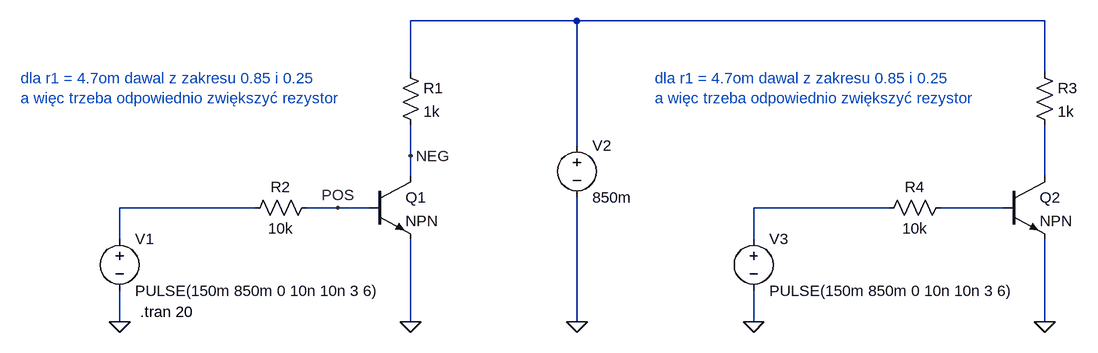
[diagram p0: schematic diff_output_trans.asc]
diff_output_trans.asc, the LTspice schematic file:
Version 4.1
SHEET 1 1320 680
WIRE 544 -112 288 -112
WIRE 1264 -112 544 -112
WIRE 288 -32 288 -112
WIRE 1264 -32 1264 -112
WIRE 544 80 544 -112
WIRE 288 96 288 48
WIRE 288 128 288 96
WIRE 1264 128 1264 48
WIRE 48 176 -160 176
WIRE 176 176 128 176
WIRE 224 176 176 176
WIRE 1024 176 816 176
WIRE 1200 176 1104 176
WIRE -160 224 -160 176
WIRE 816 224 816 176
WIRE -160 352 -160 304
WIRE 288 352 288 224
WIRE 544 352 544 160
WIRE 816 352 816 304
WIRE 1264 352 1264 224
FLAG 288 352 0
FLAG -160 352 0
FLAG 544 352 0
FLAG 1264 352 0
FLAG 816 352 0
FLAG 176 176 POS
FLAG 288 96 NEG
SYMBOL npn 224 128 R0
SYMATTR InstName Q1
SYMBOL res 272 -48 R0
SYMATTR InstName R1
SYMATTR Value 1k
SYMBOL res 144 160 R90
WINDOW 0 0 56 VBottom 2
WINDOW 3 32 56 VTop 2
SYMATTR InstName R2
SYMATTR Value 10k
SYMBOL voltage -160 208 R0
WINDOW 123 0 0 Left 0
WINDOW 39 0 0 Left 0
SYMATTR InstName V1
SYMATTR Value PULSE(150m 850m 0 10n 10n 3 6)
SYMBOL voltage 544 64 R0
WINDOW 123 0 0 Left 0
WINDOW 39 0 0 Left 0
SYMATTR InstName V2
SYMATTR Value 850m
SYMBOL npn 1200 128 R0
SYMATTR InstName Q2
SYMBOL res 1248 -48 R0
SYMATTR InstName R3
SYMATTR Value 1k
SYMBOL res 1120 160 R90
WINDOW 0 0 56 VBottom 2
WINDOW 3 32 56 VTop 2
SYMATTR InstName R4
SYMATTR Value 10k
SYMBOL voltage 816 208 R0
WINDOW 123 0 0 Left 0
WINDOW 39 0 0 Left 0
SYMATTR InstName V3
SYMATTR Value PULSE(150m 850m 0 10n 10n 3 6)
TEXT -128 336 Left 2 !.tran 20
TEXT -312 -24 Left 2 ;dla r1 = 4.7om dawal z zakresu 0.85 i 0.25 \na więc trzeba odpowiednio zwiększyć rezystor
TEXT 664 -24 Left 2 ;dla r1 = 4.7om dawal z zakresu 0.85 i 0.25 \na więc trzeba odpowiednio zwiększyć rezystor

The netlist it stands for:
* diff_output_trans.asc
Q1 NEG POS 0 0 NPN
R1 N001 NEG 1k
R2 POS N003 10k
V1 N003 0 PULSE(150m 850m 0 10n 10n 3 6)
V2 N001 0 850m
Q2 N002 N005 0 0 NPN
R3 N001 N002 1k
R4 N005 N004 10k
V3 N004 0 PULSE(150m 850m 0 10n 10n 3 6)
.model NPN NPN
.model PNP PNP
.lib standard.bjt
.tran 20
* dla r1 = 4.7om dawal z zakresu 0.85 i 0.25
* a więc trzeba odpowiednio zwiększyć rezystor
* dla r1 = 4.7om dawal z zakresu 0.85 i 0.25
* a więc trzeba odpowiednio zwiększyć rezystor
.backanno
.end

* Results of the author's LTspice run, read from the files saved beside the schematic
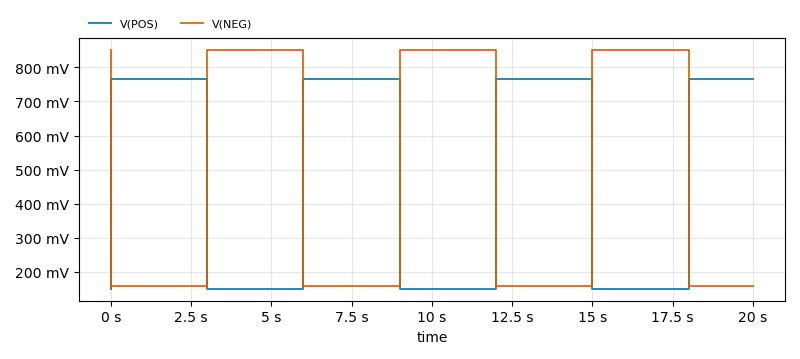
[diagram p1: Transient Analysis of diff_output_trans.asc, plotted from the saved traces]
* Transient Analysis, 1 run:
*   V(POS): min 150 mV, max 764.8 mV, average 488.2 mV, rms 576.1 mV, last 764.8 mV
*   V(NEG): min 157.7 mV, max 850 mV, average 469.3 mV, rms 582.1 mV, last 157.7 mV